# EAGLE design PowerSysPractice (EAGLE 8.5.0)
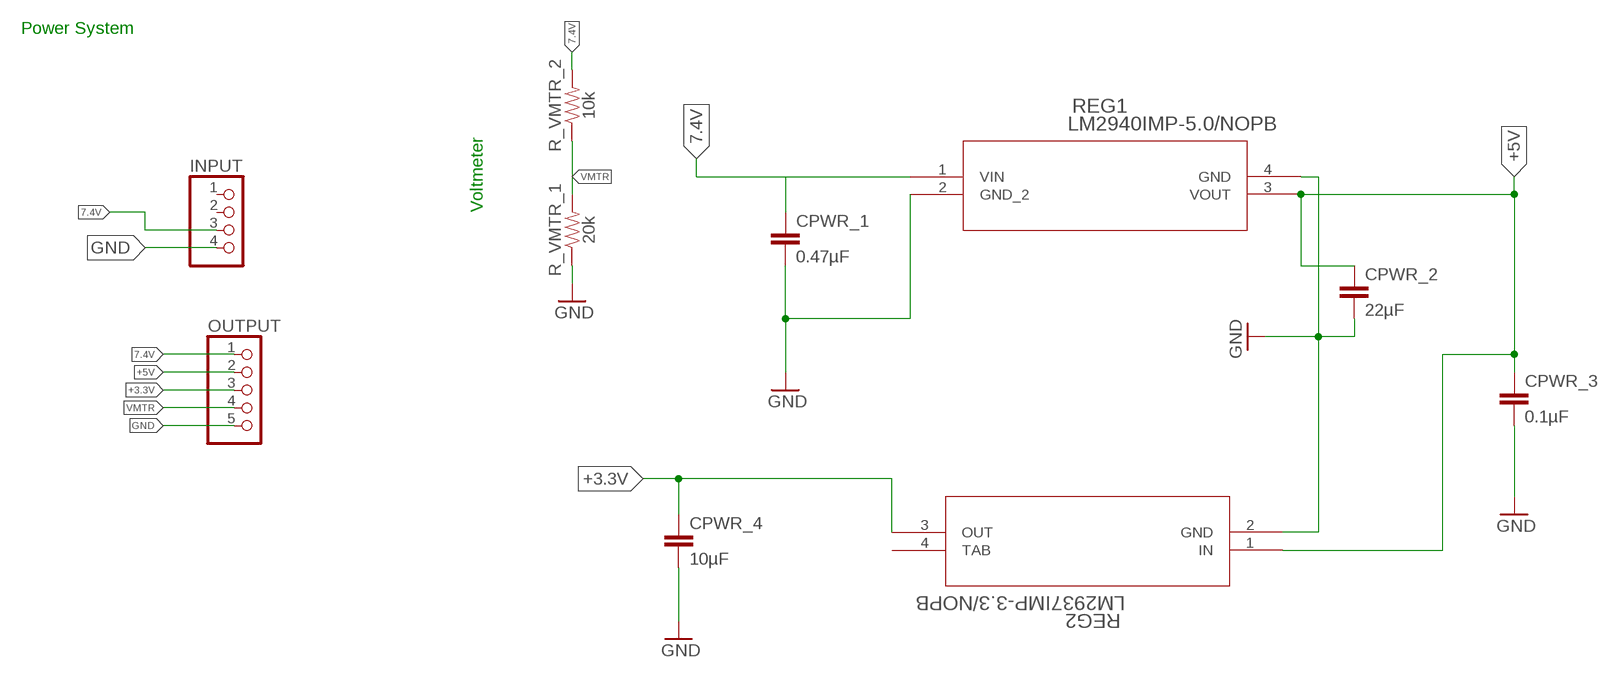
[diagram p0: schematic, sheet 1]

## Parts
CPWR_1  0.47µF  0.33UF/330NF-0805-50V-10%  [0805]
CPWR_2  22µF  0.33UF/330NF-0805-50V-10%  [0805]
CPWR_3  0.1µF  0.33UF/330NF-0805-50V-10%  [0805]
CPWR_4  10µF  0.33UF/330NF-0805-50V-10%  [0805]
INPUT  PINHD-1X4  [1X04]
OUTPUT  PINHD-1X5  [1X05]
R_VMTR_1  20k  0.75OHM-0805-1/4W-1%  [0805]
R_VMTR_2  10k  0.75OHM-0805-1/4W-1%  [0805]
REG1  LM2940IMP-5.0/NOPB  [MP04A]
REG2  LM2937IMP-3.3/NOPB  [MP04A]

## Nets
7.4V: CPWR_1.1 INPUT.3 OUTPUT.1 R_VMTR_2.2 REG1.1(VIN)
+3.3V: CPWR_4.1 OUTPUT.3 REG2.3(OUT)
+5V: CPWR_2.1 CPWR_3.1 OUTPUT.2 REG1.3(VOUT) REG2.1(IN)
GND: CPWR_1.2 CPWR_2.2 CPWR_3.2 CPWR_4.2 INPUT.4 OUTPUT.5 R_VMTR_1.1 REG1.2(GND_2) REG1.4(GND) REG2.2(GND)
VMTR: OUTPUT.4 R_VMTR_1.2 R_VMTR_2.1
Unconnected: INPUT.1 INPUT.2

## Notes on the sheet
- Power System
- Voltmeter

## Power pins joined to a net without a drawn wire
TAB: REG2.4(TAB)

## Library data of the parts
CPWR_1-CPWR_4 = SparkFun-Capacitors:0.33UF/330NF: 0.33¦ÌF/330nF ceramic capacitors A capacitor is a passive two-terminal electrical component used to store electrical energy temporarily in an electric field.; PROD_ID: CAP-08469; VALUE: 0.33¦ÌF
INPUT = pinhead:PINHD-1X4: PIN HEADER
OUTPUT = pinhead:PINHD-1X5: PIN HEADER
R_VMTR_1 R_VMTR_2 = SparkFun-Resistors:0.75OHM: 0.75¦¸ resistor A resistor is a passive two-terminal electrical component that implements electrical resistance as a circuit element. Resistors act to reduce current flow, and, at the same time, act to lower voltage levels within circuits. - Wikipedia; PROD_ID: RES-08474; VALUE: 0.75
REG1 = LM2940IMP-5.0:LM2940IMP-5.0/NOPB; 3D_LIBRARY_NAME: National_LDO; BASE_PN: LM2940; COMP: TypeLDO; COPYRIGHT: Copyright C 2015 Accelerated Designs. All rights reserved; LIBRARY: ReferenceLM2940IMP; MANUFACTURER_PART_NUMBER: LM2940IMP5.0NOPB; PIN: Count4; SYMBOL: NameLM2940IMP50; TYPE: LM2940IMP5.0; VENDOR: National Semiconductor; VERSION: 1
REG2 = LM2937IMP-3.3:LM2937IMP-3.3/NOPB; COPYRIGHT: Copyright C 2015 Accelerated Designs. All rights reserved; MANUFACTURER_PART_NUMBER: lm2937imp3_3nopb; VENDOR: National Semiconductor

## Board
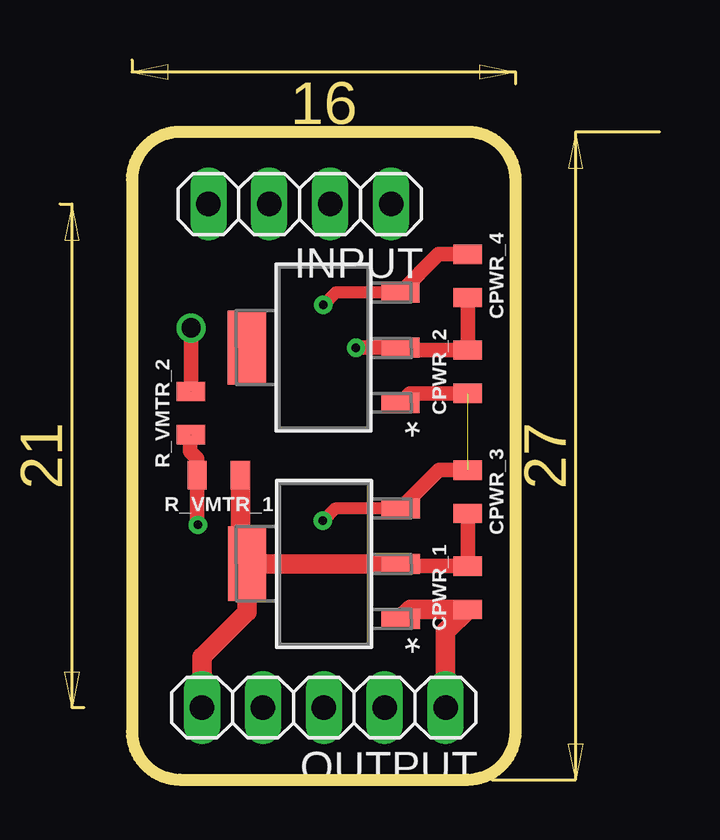
[diagram p1: board, top side]
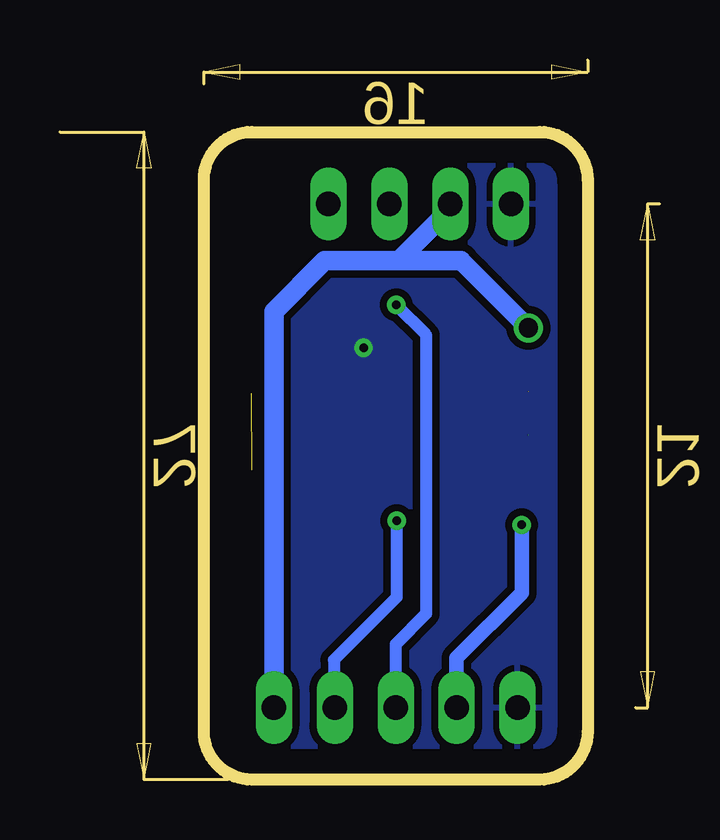
[diagram p2: board, bottom side, seen from below]

Size 16 x 27 mm. Coordinates in mm from the lower left corner, seen from the top.
Outline: 2,27 arc90 0,25 0,2 arc90 2,0 14,0 arc90 16,2 16,25 arc90 14,27 2,27
Copper layers (1*16): Top 0.035mm / dielectric 1.5mm / Bottom 0.035mm
Design rules "default": minimum track width 6mil, minimum drill 0.35mm, track to track 6mil, track to pad 6mil, pad to pad 6mil, via to via 6mil, smd to smd 6mil, copper to edge 40mil, drill to drill 6mil, minimum pad ring 10mil, minimum via ring 8mil, stop-mask expansion 4mil, vias tented up to drill 0mil, thermal gap 10mil

### Footprints (pad centres in the part's own frame; a part is rotated, then mirrored left to right if it is on the bottom)
0805 = smd 0.8 x 1.2: 1 -0.9,0; 2 0.9,0
1X04 = drill 1.016 long: 1 -3.81,0; 2 -1.27,0; 3 1.27,0; 4 3.81,0
1X05 = drill 1.016 long: 1 -5.08,0; 2 -2.54,0; 3 0,0; 4 2.54,0; 5 5.08,0
MP04A = smd 1.6 x 0.838: 1 -3.2,2.3; 2 -3.2,0; 3 -3.2,-2.3 | smd 1.6 x 3.099: 4 3.2,0

### Placement (x,y rotation side)
CPWR_1  14,8 90 top
CPWR_2  14,17 90 top
CPWR_3  14,12 270 top
CPWR_4  14,21 270 top
INPUT  7,24 180 top
OUTPUT  8,3 180 top
R_VMTR_1  3.62,12.69 180 top
R_VMTR_2  2.46,15.27 90 top
REG1  8,9 180 top
REG2  8,18.01 180 top

### Tracks (layer width: path | path; a pad name or v marks a point on that pad's centre or on a via)
7.4V  (via drill 0.8)  (1 unrouted)
  Top 0.61: R_VMTR_2.2 v2.46,18.82 v2.47,18.83
  Top 0.813: REG1.1 11.61,7.1 CPWR_1.1 13.08,6.18 OUTPUT.1
  Bottom 0.813: OUTPUT.1 13.08,19.52 10.96,21.64 7.89,21.64 | 7.89,21.64 5.73,23.8 INPUT.3 | 7.89,21.64 5.28,21.64 v2.47,18.83
+3.3V  (via drill 0.35)
  Top 0.508: REG2.3 8.5,20.31 v7.98,19.79
  Top 0.61: CPWR_4.1 12.79,21.9 REG2.3
  Bottom 0.508: 7.98,3.02 OUTPUT.3 8,5.64 6.72,6.92 6.72,18.53 v7.98,19.79
+5V  (via drill 0.35)  (1 unrouted)
  Top 0.508: REG1.3 8.47,11.3 v7.96,10.79
  Top 0.61: CPWR_2.1 11.59,16.1 REG2.1 | CPWR_3.1 12.81,12.9 REG1.3
  Bottom 0.508: v7.96,10.79 7.96,7.6 10.58,4.98 10.58,3.04 OUTPUT.2
GND  (via drill 0.35)
  Top 0.254: CPWR_1.2 13.98,8.91 13.9,9 | CPWR_3.2 13.95,11.05
  Top 0.61: CPWR_4.2 CPWR_2.2 11.3,17.9 REG2.2 v9.35,18.01 v9.34,18 | CPWR_3.2 14,8.93 13.98,8.91 | CPWR_1.2 11.3,8.9 REG1.2
  Top 0.813: REG1.2 REG1.4 | R_VMTR_1.1 4.52,9.28 REG1.4 | REG1.4 4.8,6.99 2.93,5.12 OUTPUT.5
  pour Bottom (isolate 0.305): 24.31,-6.65 24.31,29.52 21.73,32.1 -3.28,32.1 -6.59,28.79 -6.59,-8.59 -5.94,-9.24 21.47,-9.24 24.06,-6.65
VMTR  (via drill 0.35)  (1 unrouted)
  Top 0.61: R_VMTR_2.1 2.42,14.33 2.42,13.68 2.72,13.38 R_VMTR_1.2 2.72,10.65 v2.75,10.62
  Bottom 0.61: v2.75,10.62 2.75,7.79 5.46,5.08 OUTPUT.4